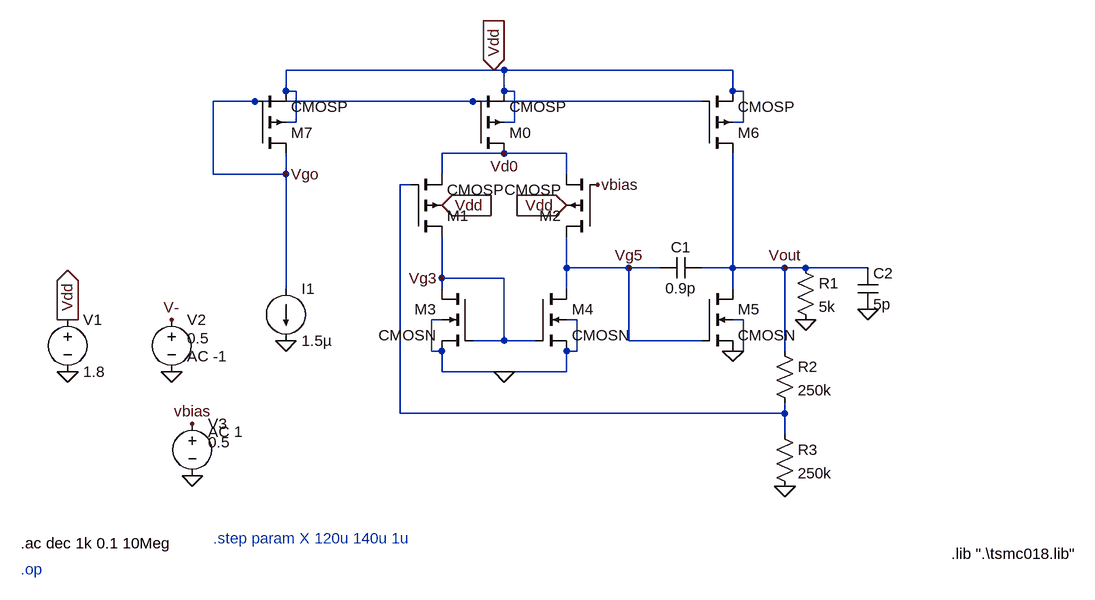
[diagram p0: schematic OpAmpDesignNew.asc]
OpAmpDesignNew.asc, the LTspice schematic file:
Version 4
SHEET 1 2976 1864
WIRE 1824 1008 1504 1008
WIRE 1840 1008 1824 1008
WIRE 2192 1008 1840 1008
WIRE 1504 1040 1504 1008
WIRE 1520 1040 1504 1040
WIRE 1840 1040 1840 1008
WIRE 1856 1040 1840 1040
WIRE 2192 1040 2192 1008
WIRE 2208 1040 2192 1040
WIRE 1440 1056 1392 1056
WIRE 1456 1056 1440 1056
WIRE 1728 1056 1456 1056
WIRE 1792 1056 1728 1056
WIRE 2064 1056 1792 1056
WIRE 2144 1056 2064 1056
WIRE 1520 1088 1520 1040
WIRE 1520 1088 1504 1088
WIRE 1856 1088 1856 1040
WIRE 1856 1088 1840 1088
WIRE 2208 1088 2208 1040
WIRE 2208 1088 2192 1088
WIRE 1840 1136 1744 1136
WIRE 1888 1136 1840 1136
WIRE 1936 1136 1888 1136
WIRE 1392 1168 1392 1056
WIRE 1504 1168 1504 1136
WIRE 1504 1168 1392 1168
WIRE 1744 1168 1744 1136
WIRE 1936 1168 1936 1136
WIRE 1696 1184 1680 1184
WIRE 1744 1280 1744 1264
WIRE 1936 1312 1936 1264
WIRE 2032 1312 1936 1312
WIRE 2080 1312 2032 1312
WIRE 2192 1312 2192 1136
WIRE 2192 1312 2144 1312
WIRE 2272 1312 2192 1312
WIRE 2304 1312 2272 1312
WIRE 2352 1312 2304 1312
WIRE 2400 1312 2352 1312
WIRE 1744 1328 1744 1280
WIRE 1840 1328 1744 1328
WIRE 1504 1344 1504 1168
WIRE 1744 1344 1744 1328
WIRE 1936 1344 1936 1312
WIRE 2192 1344 2192 1312
WIRE 1744 1392 1728 1392
WIRE 1952 1392 1936 1392
WIRE 2208 1392 2192 1392
WIRE 1840 1424 1840 1328
WIRE 1840 1424 1792 1424
WIRE 1888 1424 1840 1424
WIRE 2032 1424 2032 1312
WIRE 2144 1424 2032 1424
WIRE 1728 1440 1728 1392
WIRE 1744 1440 1728 1440
WIRE 1952 1440 1952 1392
WIRE 1952 1440 1936 1440
WIRE 2208 1440 2208 1392
WIRE 2208 1440 2192 1440
WIRE 2272 1440 2272 1312
WIRE 1936 1456 1936 1440
WIRE 1744 1472 1744 1440
WIRE 1840 1472 1744 1472
WIRE 1936 1472 1936 1456
WIRE 1936 1472 1840 1472
WIRE 1680 1536 1680 1184
WIRE 2176 1536 1680 1536
WIRE 2272 1536 2272 1520
WIRE 2272 1536 2176 1536
WIRE 2272 1568 2272 1536
FLAG 1504 1424 0
FLAG 1840 1472 0
FLAG 2192 1440 0
FLAG 1824 1008 Vdd
IOPIN 1824 1008 In
FLAG 1168 1472 0
FLAG 1168 1392 Vdd
IOPIN 1168 1392 Out
FLAG 2304 1392 0
FLAG 2400 1376 0
FLAG 2272 1648 0
FLAG 1328 1472 0
FLAG 1328 1392 V-
FLAG 1504 1168 Vgo
FLAG 1840 1136 Vd0
FLAG 1744 1328 Vg3
FLAG 2032 1312 Vg5
FLAG 2272 1312 Vout
FLAG 1744 1216 Vdd
IOPIN 1744 1216 In
FLAG 1936 1216 Vdd
IOPIN 1936 1216 In
FLAG 1360 1552 vbias
FLAG 1360 1632 0
FLAG 1984 1184 vbias
DATAFLAG 1728 1056 ""
DATAFLAG 1744 1280 ""
DATAFLAG 1936 1312 ""
DATAFLAG 1936 1456 ""
DATAFLAG 1440 1056 ""
DATAFLAG 2352 1312 ""
DATAFLAG 1888 1136 ""
DATAFLAG 2064 1056 ""
DATAFLAG 2208 1088 ""
DATAFLAG 2176 1536 ""
DATAFLAG 2272 1312 ""
DATAFLAG 2272 1312 ""
SYMBOL pmos4 1696 1264 M180
SYMATTR InstName M1
SYMATTR Value CMOSP
SYMATTR Value2 l=1u w=15u ad=1.63296p as=1.63296p pd=9.792u ps=9.792u
SYMBOL pmos4 1792 1136 M180
SYMATTR InstName M0
SYMATTR Value CMOSP
SYMATTR Value2 l=5u w=25u ad=9p as=9p pd=50.72u ps=50.72u
SYMBOL pmos4 1456 1136 M180
SYMATTR InstName M7
SYMATTR Value CMOSP
SYMATTR Value2 l=1u w=1u ad=0.36p as=0.36p pd=2.72u ps=2.72u
SYMBOL pmos4 2144 1136 M180
SYMATTR InstName M6
SYMATTR Value CMOSP
SYMATTR Value2 l=1u w=168.5u ad=49.86p as=49.86p pd=277.72u ps=277.72u
SYMBOL nmos4 1792 1344 M0
SYMATTR InstName M3
SYMATTR Value CMOSN
SYMATTR Value2 l=1u w=1u ad=0.710208p as=0.710208p pd=4.6656u ps=4.6656u
SYMBOL current 1504 1344 R0
WINDOW 123 0 0 Left 2
WINDOW 39 0 0 Left 2
SYMATTR InstName I1
SYMATTR Value 1.5µ
SYMBOL pmos4 1984 1264 R180
SYMATTR InstName M2
SYMATTR Value CMOSP
SYMATTR Value2 l=1u w=15u ad=1.63296p as=1.63296p pd=9.792u ps=9.792u
SYMBOL nmos4 1888 1344 R0
SYMATTR InstName M4
SYMATTR Value CMOSN
SYMATTR Value2 l=1u w=1u ad=0.710208p as=0.710208p pd=4.6656u ps=4.6656u
SYMBOL nmos4 2144 1344 R0
SYMATTR InstName M5
SYMATTR Value2 l=0.18u w=1.089u ad=0.39204p as=0.39204p pd=2.898u ps=2.898u
SYMATTR Value CMOSN
SYMBOL cap 2144 1296 R90
WINDOW 0 0 32 VBottom 2
WINDOW 3 32 32 VTop 2
SYMATTR InstName C1
SYMATTR Value 0.9p
SYMBOL voltage 1168 1376 R0
WINDOW 123 0 0 Left 2
WINDOW 39 0 0 Left 2
SYMATTR InstName V1
SYMATTR Value 1.8
SYMBOL res 2288 1296 R0
SYMATTR InstName R1
SYMATTR Value 5k
SYMBOL cap 2384 1312 R0
SYMATTR InstName C2
SYMATTR Value 5p
SYMBOL res 2256 1424 R0
SYMATTR InstName R2
SYMATTR Value 250k
SYMBOL res 2256 1552 R0
SYMATTR InstName R3
SYMATTR Value 250k
SYMBOL voltage 1328 1376 R0
WINDOW 3 24 44 Left 2
WINDOW 123 24 72 Left 2
WINDOW 39 0 0 Left 2
SYMATTR Value 0.5
SYMATTR Value2 AC -1
SYMATTR InstName V2
SYMBOL voltage 1360 1536 R0
WINDOW 3 24 44 Left 2
WINDOW 123 24 28 Left 2
WINDOW 39 0 0 Left 2
SYMATTR Value 0.5
SYMATTR Value2 AC 1
SYMATTR InstName V3
TEXT 2528 1752 Left 2 !.lib ".\\tsmc018.lib"
TEXT 1096 1776 Left 2 ;.op
TEXT 1096 1736 Left 2 !.ac dec 1k 0.1 10Meg
TEXT 1392 1728 Left 2 ;.step param X 120u 140u 1u

The netlist it stands for:
* OpAmpDesignNew.asc
M1 Vg3 N001 Vd0 Vdd CMOSP l=1u w=15u ad=1.63296p as=1.63296p pd=9.792u ps=9.792u
M0 Vd0 Vgo Vdd Vdd CMOSP l=5u w=25u ad=9p as=9p pd=50.72u ps=50.72u
M7 Vgo Vgo Vdd Vdd CMOSP l=1u w=1u ad=0.36p as=0.36p pd=2.72u ps=2.72u
M6 Vout Vgo Vdd Vdd CMOSP l=1u w=168.5u ad=49.86p as=49.86p pd=277.72u ps=277.72u
M3 Vg3 Vg3 0 0 CMOSN l=1u w=1u ad=0.710208p as=0.710208p pd=4.6656u ps=4.6656u
I1 Vgo 0 1.5µ
M2 Vg5 vbias Vd0 Vdd CMOSP l=1u w=15u ad=1.63296p as=1.63296p pd=9.792u ps=9.792u
M4 Vg5 Vg3 0 0 CMOSN l=1u w=1u ad=0.710208p as=0.710208p pd=4.6656u ps=4.6656u
M5 Vout Vg5 0 0 CMOSN l=0.18u w=1.089u ad=0.39204p as=0.39204p pd=2.898u ps=2.898u
C1 Vout Vg5 0.9p
V1 Vdd 0 1.8
R1 Vout 0 5k
C2 Vout 0 5p
R2 Vout N001 250k
R3 N001 0 250k
V2 V- 0 0.5 AC -1
V3 vbias 0 0.5 AC 1
.model NMOS NMOS
.model PMOS PMOS
.lib standard.mos
.lib ".\tsmc018.lib"
* .op
.ac dec 1k 0.1 10Meg
* .step param X 120u 140u 1u
.backanno
.end